# Altium schematic sheet 数控936 模拟部分.SchDoc
size A4
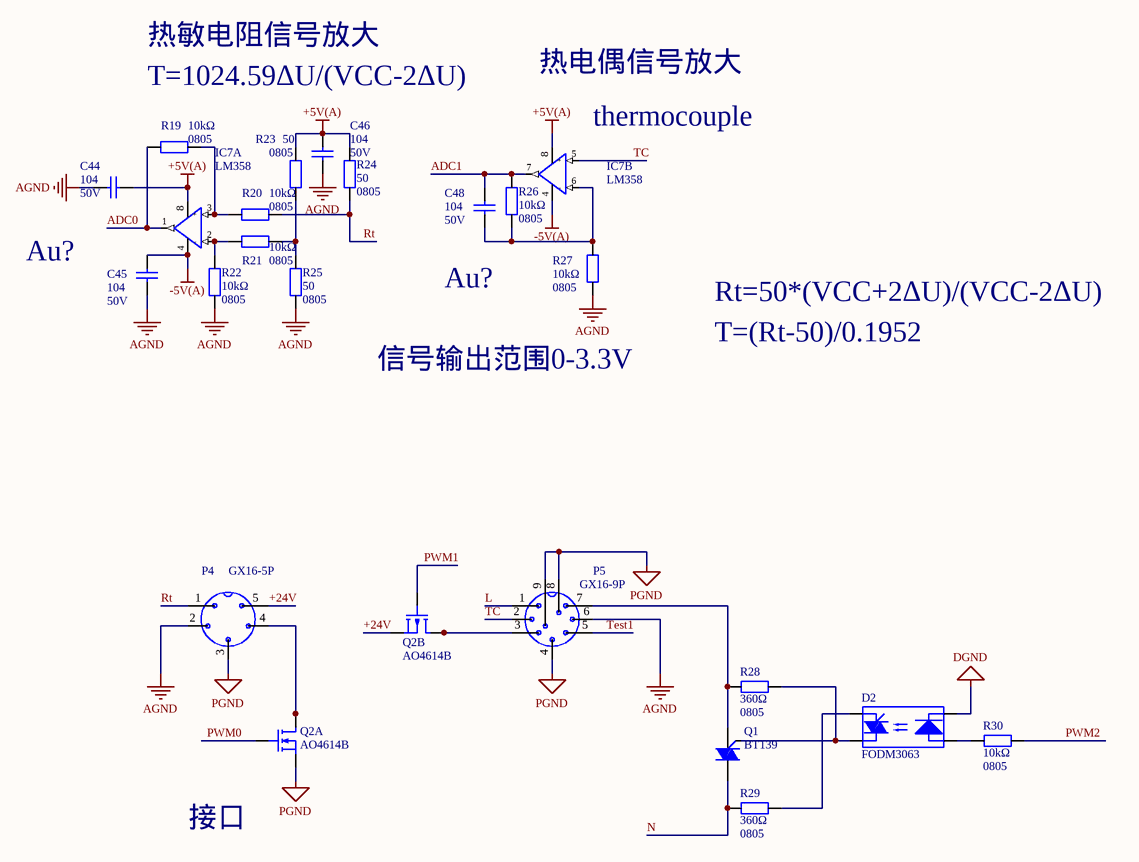
[diagram p0: 数控936 模拟部分.SchDoc]

## Parts
C44  104  value 50V  [C0805]
C45  104  value 50V  [C0805]
C46  104  value 50V  [C0805]
C48  104  value 50V  [C0805]
D2  FODM3063  [SOP4-2.54]
IC7  LM358  [SOP-8(体宽3.8mm)]  (parts A,B of 2)
P4  GX16-5P  [GX16-5P]
P5  GX16-9P  [GX16-9P]
Q1  BT139  [TO-252]
Q2  AO4614B  [SOP-8(体宽3.8mm)]  (parts A,B of 2)
R19  10kΩ  value 0805  [R0805]
R20  10kΩ  value 0805  [R0805]
R21  10kΩ  value 0805  [R0805]
R22  10kΩ  value 0805  [R0805]
R23  50  value 0805  [R0805]
R24  50  value 0805  [R0805]
R25  50  value 0805  [R0805]
R26  10kΩ  value 0805  [R0805]
R27  10kΩ  value 0805  [R0805]
R28  360Ω  value 0805  [R0805]
R29  360Ω  value 0805  [R0805]
R30  10kΩ  value 0805  [R0805]

## Nets
+5V(A): C44.2 C46.2 IC7.8(vcc) R23.2 R24.2
-5V(A): C45.2 IC7.4(vee)
AGND: C44.1 C45.1 C46.1 P4.2(传感器-) P5.6 R22.1 R25.1 R27.1
DGND: D2.2(cathode)
PGND: P4.3(地) P5.4 P5.8 P5.9 Q2.1(S)
+24V: P4.5(加热) Q2.3(S)
ADC0: IC7.1(out) R19.1
ADC1: C48.2 IC7.7(out) R26.1
L: P5.1
N: Q1.2(A2) R29.1
PWM0: Q2.2(G)
PWM1: Q2.4(G)
PWM2: R30.1
Rt: P4.1(传感器+) R20.2 R24.1
TC: IC7.5(+) P5.2
Test1: P5.5
NetC48_1: C48.1 IC7.6(-) R26.2 R27.2
NetD2_1: D2.1(anode) R30.2
NetD2_3: D2.3(main_term) R29.2
NetD2_4: D2.4(main_term) Q1.3(G) R28.1
NetIC7_2: IC7.2(-) R21.1 R22.2
NetIC7_3: IC7.3(+) R19.2 R20.1
NetP4_4: P4.4(加热) Q2.7(D) Q2.8(D)
NetP5_3: P5.3 Q2.5(D) Q2.6(D)
NetP5_7: P5.7 Q1.1(A1) R28.2
NetR21_2: R21.2 R23.1 R25.2

## Notes on the sheet
- 热敏电阻信号放大
- T=1024.59ΔU/(VCC-2ΔU)
- 热电偶信号放大
- (near IC7) thermocouple
- Au?
- Rt=50*(VCC+2ΔU)/(VCC-2ΔU)
- 信号输出范围0-3.3V
- T=(Rt-50)/0.1952
- 接口

## Library data of the parts
C44-C46 C48 = 104: 无极性电容
D2 = FODM3063: 过零光耦
IC7 = LM358: 运放
P4 = GX16-5P: 航空插座
P5 = GX16-9P: 航空插座
Q1 = BTA16: 双向可控硅
Q2 = AO4614B: N-P复合MOSFET
R19-R30 = 10kΩ: 贴片/直插电阻